# EAGLE schematic SensingMethods (EAGLE 7.7.0)
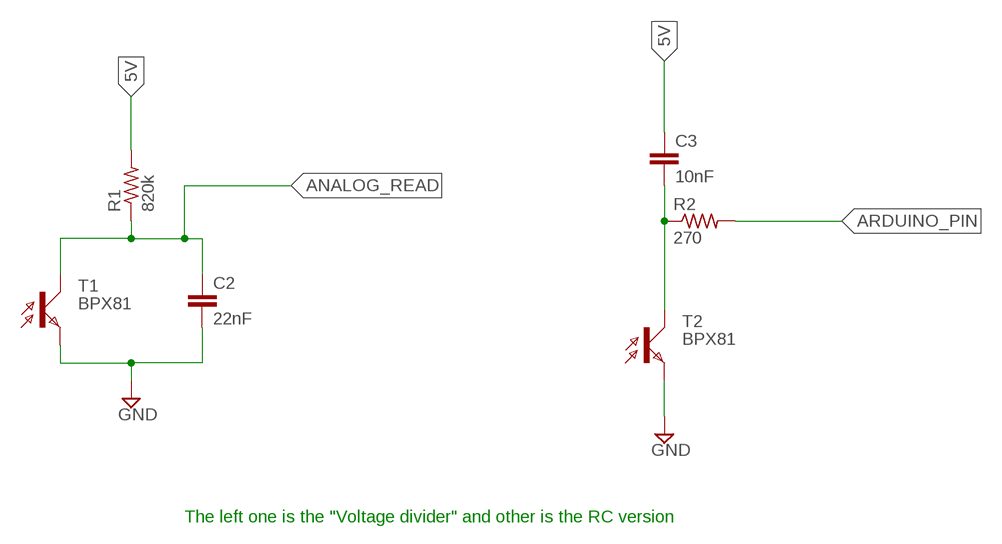
[diagram p0: schematic, sheet 1]

## Parts
C2  22nF  C-EUC1808  [C1808]
C3  10nF  C-EUC1808  [C1808]
R1  820k  R-US_R0805  [R0805]
R2  270  R-US_R1210  [R1210]
T1  BPX81  [BPX81]
T2  BPX81  [BPX81]

## Nets
5V: C3.1 R1.2
ANALOG_READ: C2.1 R1.1 T1.C
ARDUINO_PIN: R2.2
GND: C2.2 T1.E T2.E
N$1: C3.2 R2.1 T2.C

## Notes on the sheet
- The left one is the "Voltage divider" and other is the RC version

## Library data of the parts
C2 C3 = resistor:C-EU: CAPACITOR, European symbol
R1 R2 = rcl:R-US_: RESISTOR, American symbol
T1 T2 = opto-trans-siemens:BPX81: PHOTO TRANSISTOR; OC_FARNELL: unknown; OC_NEWARK: unknown